# Altium schematic sheet Input_Output.SchDoc
size A; SheetNumber: 5; SheetTotal: 5
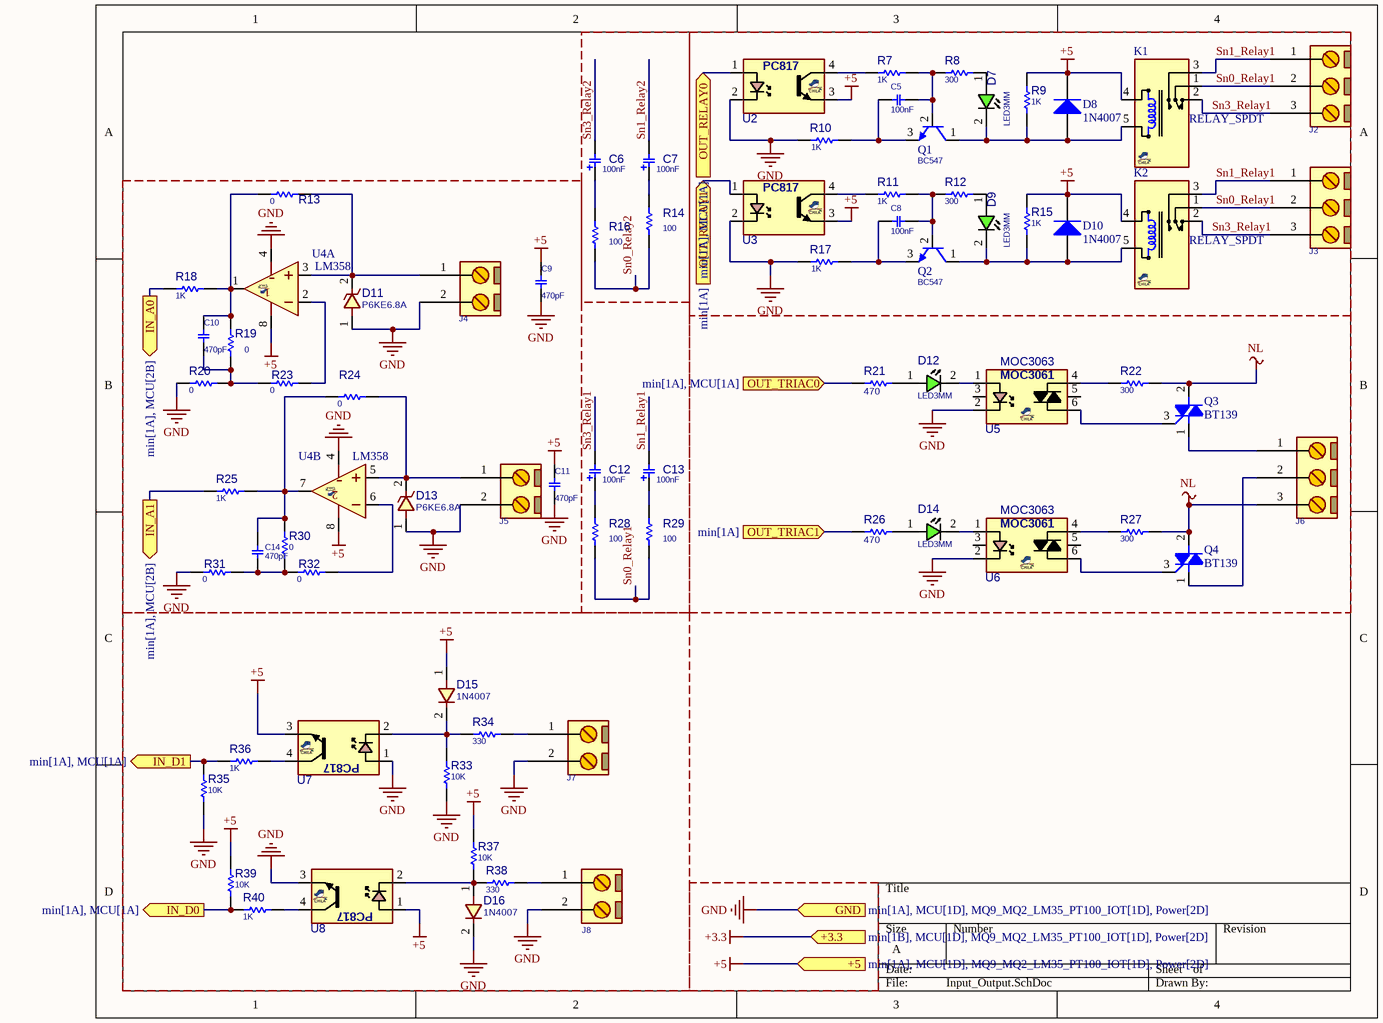
[diagram p0: Input_Output.SchDoc]

## Parts
C5  100nF  [C_CERM_D3]
C6  100nF  [C_FLM_10X5H7]
C7  100nF  [C_FLM_10X5H7]
C8  100nF  [C_CERM_D3]
C9  470pF  [C_CERM_D3]
C10  470pF  [C_CERM_D3]
C11  470pF  [C_CERM_D3]
C12  100nF  [C_FLM_10X5H7]
C13  100nF  [C_FLM_10X5H7]
C14  470pF  [C_CERM_D3]
D7  LED3MM  [LED3MM]
D8  1N4007  [Diode 1n4007]
D9  LED3MM  [LED3MM]
D10  1N4007  [Diode 1n4007]
D11  P6KE6.8A  [D_AX04_DO41]
D12  LED3MM  [LED3MM]
D13  P6KE6.8A  [D_AX04_DO41]
D14  LED3MM  [LED3MM]
D15  1N4007  [D_AX04_DO41]
D16  1N4007  [D_AX04_DO41]
J2  CONN_GMSTB3  [GMSTB762_3]  (value not drawn)
J3  CONN_GMSTB3  [GMSTB762_3]  (value not drawn)
J4  CONN_GMSTB2  [GMSTB762_2]  (value not drawn)
J5  CONN_GMSTB2  [GMSTB762_2]  (value not drawn)
J6  CONN_GMSTB3  [GMSTB762_3]  (value not drawn)
J7  CONN_GMSTB2  [GMSTB762_2]  (value not drawn)
J8  CONN_GMSTB2  [GMSTB762_2]  (value not drawn)
K1  RELAY_SPDT  [REL_SPDT_5_2216]
K2  RELAY_SPDT  [REL_SPDT_5_2216]
Q1  BC547  [TO92_3]
Q2  BC547  [TO92_3]
Q3  BT139  [TO220_3]
Q4  BT139  [TO220_3]
R7  1k  [R025W_AX_VER]
R8  300  [R025W_AX_VER]
R9  1k  [R025W_AX_VER]
R10  1K  [R025W_AX_VER]
R11  1k  [R025W_AX_VER]
R12  300  [R025W_AX_VER]
R13  0  [R0125W_AX03]
R14  100  [R025W_AX_VER]
R15  1k  [R025W_AX_VER]
R16  100  [R025W_AX_VER]
R17  1K  [R025W_AX_VER]
R18  1K  [R0125W_AX03]
R19  0  [R0125W_AX03]
R20  0  [R0125W_AX03]
R21  470  [R1206]
R22  300  [R025W_AX_VER]
R23  0  [R0125W_AX03]
R24  0  [R0125W_AX03]
R25  1K  [R0125W_AX03]
R26  470  [R1206]
R27  300  [R025W_AX_VER]
R28  100  [R025W_AX_VER]
R29  100  [R025W_AX_VER]
R30  0  [R0125W_AX03]
R31  0  [R0125W_AX03]
R32  0  [R0125W_AX03]
R33  10K  [R0125W_AX03]
R34  330  [R0125W_AX03]
R35  10K  [R0125W_AX03]
R36  1K  [R0125W_AX03]
R37  10K  [R0125W_AX03]
R38  330  [R0125W_AX03]
R39  10K  [R0125W_AX03]
R40  1K  [R0125W_AX03]
U2  PC817  [DIP_4]  (value not drawn)
U3  PC817  [DIP_4]  (value not drawn)
U4  LM358  [DIP_8]  (parts A,B of 2)
U5  MOC3063  [DIP_6]
U6  MOC3063  [DIP_6]
U7  PC817  [DIP_4]  (value not drawn)
U8  PC817  [DIP_4]  (value not drawn)

## Ports
+3.3 (in, see min[1B], MCU[1D], MQ9_MQ2_LM35_PT100_IOT[1D], Power[2D]), +5 (in, see min[1A], MCU[1D], MQ9_MQ2_LM35_PT100_IOT[1D], Power[2D]), GND (in, see min[1A], MCU[1D], MQ9_MQ2_LM35_PT100_IOT[1D], Power[2D]), IN_A0 (out, see min[1A], MCU[2B]), IN_A1 (out, see min[1A], MCU[2B]), IN_D0 (out, see min[1A], MCU[1A]), IN_D1 (out, see min[1A], MCU[1A]), OUT_RELAY0 (in, see min[1A], MCU[1A]), OUT_RELAY1 (in, see min[1A]), OUT_TRIAC0 (in, see min[1A], MCU[1A]), OUT_TRIAC1 (in, see min[1A])

## Nets
+3.3: port +3.3
+5: C9.2 C11.2 D8.2(K) D10.2(K) D15.1 K1.4(T1) K2.4(T1) R9.1 R15.1 R37.2 R39.2 U2.3(E) U3.3(E) U4.8(V+) U7.3(E) U8.1(A) ; port +5
GND: C9.1 C11.1 D11.1 D13.1 D16.2 J4.2 J5.2 J7.2 J8.2 R10.2 R17.2 R20.2 R31.2 R33.2 R35.2 U2.2(K) U3.2(K) U4.4(V-) U5.2(K) U6.2(K) U7.1(A) U8.3(E) ; port GND
NL: J6.3 Q3.2(T2) Q4.2(T2) R22.2 R27.2
IN_A0: R18.2 ; port IN_A0
IN_A1: R25.2 ; port IN_A1
IN_D0: R39.1 R40.1 ; port IN_D0
IN_D1: R35.1 R36.1 ; port IN_D1
OUT_RELAY0: U2.1(A) ; port OUT_RELAY0
OUT_RELAY1: U3.1(A) ; port OUT_RELAY1
OUT_TRIAC0: R21.2 ; port OUT_TRIAC0
OUT_TRIAC1: R26.2 ; port OUT_TRIAC1
Sn0_Relay1: J2.2 J3.2 K1.1(COM) K2.1(COM) R28.1 R29.1
Sn0_Relay2: R14.1 R16.1
Sn1_Relay1: C13.2 J2.1 J3.1 K1.3(NO) K2.3(NO)
Sn1_Relay2: C7.2
Sn3_Relay1: C12.2 J2.3 J3.3 K1.2(NC) K2.2(NC)
Sn3_Relay2: C6.2
NetC5_1: C5.1 Q1.2(B) R7.1 R8.1
NetC5_2: C5.2 Q1.3(E) R10.1
NetC6_1: C6.1 R16.2
NetC7_1: C7.1 R14.2
NetC8_1: C8.1 Q2.2(B) R11.1 R12.1
NetC8_2: C8.2 Q2.3(E) R17.1
NetC10_1: C10.1 R19.2 R20.1 R23.1
NetC10_2: C10.2 R13.2 R18.1 R19.1 U4.1(OUT)
NetC12_1: C12.1 R28.2
NetC13_1: C13.1 R29.2
NetC14_1: C14.1 R30.1 R31.1 R32.1
NetC14_2: C14.2 R24.1 R25.1 R30.2 U4.7(OUT)
NetD7_1: D7.1(ANODE) R8.2
NetD7_2: D7.2(CATHODE) D8.1(A) K1.5(T2) Q1.1(C) R9.2
NetD9_1: D9.1(ANODE) R12.2
NetD9_2: D9.2(CATHODE) D10.1(A) K2.5(T2) Q2.1(C) R15.2
NetD11_2: D11.2 J4.1 R13.1 U4.3(IN+)
NetD12_1: D12.1(ANODE) R21.1
NetD12_2: D12.2(CATHODE) U5.1(A)
NetD13_2: D13.2 J5.1 R24.2 U4.5(IN+)
NetD14_1: D14.1(ANODE) R26.1
NetD14_2: D14.2(CATHODE) U6.1(A)
NetD15_2: D15.2 R33.1 R34.1 U7.2(K)
NetD16_1: D16.1 R37.1 R38.1 U8.2(K)
NetJ6_1: J6.1 Q3.1(T1)
NetJ6_2: J6.2 Q4.1(T1)
NetJ7_1: J7.1 R34.2
NetJ8_1: J8.1 R38.2
NetQ3_3: Q3.3(G) U5.6(A/K)
NetQ4_3: Q4.3(G) U6.6(A/K)
NetR7_2: R7.2 U2.4(C)
NetR11_2: R11.2 U3.4(C)
NetR22_1: R22.1 U5.4(A/K)
NetR23_2: R23.2 U4.2(IN-)
NetR27_1: R27.1 U6.4(A/K)
NetR32_2: R32.2 U4.6(IN-)
NetR36_2: R36.2 U7.4(C)
NetR40_2: R40.2 U8.4(C)

Not connected (* = marked no-connect by the designer): U5 3(NC) 5(NC); U6 3(NC) 5(NC)

## Library data of the parts
C5 C8-C11 C14 = CAP_THD_CER: CAP, THD, CER MULTI LAYER,; DESC: CAP, CER MULTI LAYER,; MANF_P#: MANF_PART#; PARAM2: 50V; PRICE: 100= 1$; MANF: MANF; ASSEMBLY: ASSEMBLY
  C5 C8: VALUE: 100nF
  C9-C11 C14: VALUE: 470pF
C6 C7 C12 C13 = CAP_THD_FLM: CAP, THD, FILM,; MANF_P#: MANF_PART#; PARAM2: 25V; DESC: DESCRIPTION; DIST#: MOUSER; PARAM: 20%; PRICE: 10= 5$; MANF: MANF; ASSEMBLY: ASSEMBLY; VALUE: 100nF
D7 D9 D12 D14 = LED_THD_3MM: LED, THD, 3MM, GREEN; DESC: DESCRIPTION; MANF_P#: MANF_PART#; PARAM2: 2.2V; MANF: MANF; ASSEMBLY: ASSEMBLY; PRICE: PRICE; VALUE: LED3MM
D8 D10 = Diode: Published: 8-Jun-2000; LatestRevisionDate: 17-Jul-2002; LatestRevisionNote: Re-released for DXP Platform.; DatasheetVersion: 1997; Publisher: Altium Limited; PackageDescription: Diode, Axial; Body 3.8 x 1.9 mm (LxDia. max), Lead Dia. 0.53 mm (max); Code_JEDEC: DO-204-AH; ComponentLink1Description: Manufacturer Link; ComponentLink1URL: http://www.fairchildsemi.com/; ComponentLink2Description: Datasheet; ComponentLink2URL: http://www.fairchildsemi.com/ds/1N%2F1N4148.pdf
D11 D13 = DIODE_THD_ZENER: DIODE, ZENER, 0.2W, 15V; MANF: Diodes; DESC: DESCRIPTION; MANF_P#: ZENER15V; ASSEMBLY: ASSEMBLY; PRICE: PRICE; PARAM2: 0.2W; PARAM: 15V; VALUE: P6KE6.8A
D15 D16 = DIODE_THD_1N4007: DIODE, GENERAL PURPOSE, 1000V/1A; MANF: Diodes; DESC: DESCRIPTION; PARAM: 1000V, 1.15V; PARAM2: 1.5A; ASSEMBLY: ASSEMBLY; PRICE: PRICE; MANF_P#: 1N4007; VALUE: 1N4007
J2 J3 J6 = CONN_GMSTB762_3: CONN, PHOENIX MSTB, 5-G, 5.08mm pitch; MANF_P#: GMSTB 2,5/3-G-7,62; PARAM2: 630V; PARAM: 12A; VALUE: CONN_GMSTB3
J4 J5 J7 J8 = CONN_GMSTB762_2: CONN, PHOENIX GMSTB, 7.62mm pitch; MANF_P#: GMSTB 2,5/2-G-7,62; PARAM2: 630V; PARAM: 12A; VALUE: CONN_GMSTB2
K1 K2 = RELAY_SPDT_5_2216_HJR-3FF: Relay, SPDT, 5P, 19X15mm, 240VAC/7A; MANF: TIANBO; MANF_P#: HJR-3FF--12VDC; PARAM2: 7A, 240VAC /10A 120VAC/24VDC; PARAM: 12V, 30mA, 400Ohm; PRICE: PRICE; Value: RELAY_SPDT
Q1 Q2 = NPN_BC547_TO92: BJT, NPN, 45v, 0.1A, THD, TO92; PARAM: 0.1A, Hfe110~800; PARAM2: 45v, 500mW; MANF: FAIRCHILD; MANF_P#: BC547; VALUE: BC547
Q3 Q4 = TRIAC: Triac, 600V, 4A, TO-220, Silicon Bidirectional Thyristor; VALUE: BT136; MANF_P#: *; MANF: *; PRICE: toman@PAYA
R7-R13 R15 R17-R20 R22-R25 R27 R30-R40 = RES_THD: RESISTOR, THD; MANF_P#: RK73H1ETTP4701F; MANF: KOA SPEER; PARAM: 0.063W; DESC: DESCRIPTION; DIST#: MOUSER; PARAM2: 1%; ASSEMBLY: ASSEMBLY; PRICE: 100= 0.5$
  R7 R9-R11 R15 R17 R18 R25 R36 R40: VALUE: 1K
  R8 R12 R22 R27: VALUE: 300
  R13 R19 R20 R23 R24 R30-R32: VALUE: 0
  R33 R35 R37 R39: VALUE: 10K
  R34 R38: VALUE: 330
R14 R16 R28 R29 = RES_THD: RESISTOR, THD; MANF_P#: RK73H1ETTP4701F; MANF: KOA SPEER; PARAM: 0.063W; DESC: DESCRIPTION; DIST#: MOUSER; PARAM2: 1%; VALUE: 10K; ASSEMBLY: ASSEMBLY; PRICE: 100= 0.5$
R21 R26 = RES_SMD: RESISTOR, SMD; PARAM: -W; DESC: DESCRIPTION; DIST#: MOUSER; PARAM2: 1%; MANF_P#: -; MANF: -; ASSEMBLY: ASSEMBLY; PRICE: 100= 0.5$; VALUE: 470
U2 U3 U7 U8 = OPTC_TR4P_PC817: OPTOCOUPLER, TRANSISTOR, 4PIN; PARAM: IF=20mA; PARAM2: VCE = 35V; MANF: SHARP; MANF_P#: PC817; PRICE: -; VALUE: PC817; PACKAGE: DIP-4
U4 = LM358_DIP8: AMP, Dual, Low-Power; MANF: Texas Instruments, Fairchild; MANF_P#: LM358AN; PARAM2: 3 V ~ 32 V, ±1.5 V ~ 16 V; PRICE: -; VALUE: LM358
U5 U6 = OPT_TRIAC6P_MOC3061: OPTOTRIAC, 600v/1A, 6v In; PARAM2: 300mW, -40~85°C; PARAM: 6v/60mA IN/ 600v/1A out; MANF_P#: MOC3061; PRICE: 5t@paya; VALUE: MOC3061; PACKAGE: DIP-6